# Altium project lamp_controller.PrjPcb (part 1 of 4)
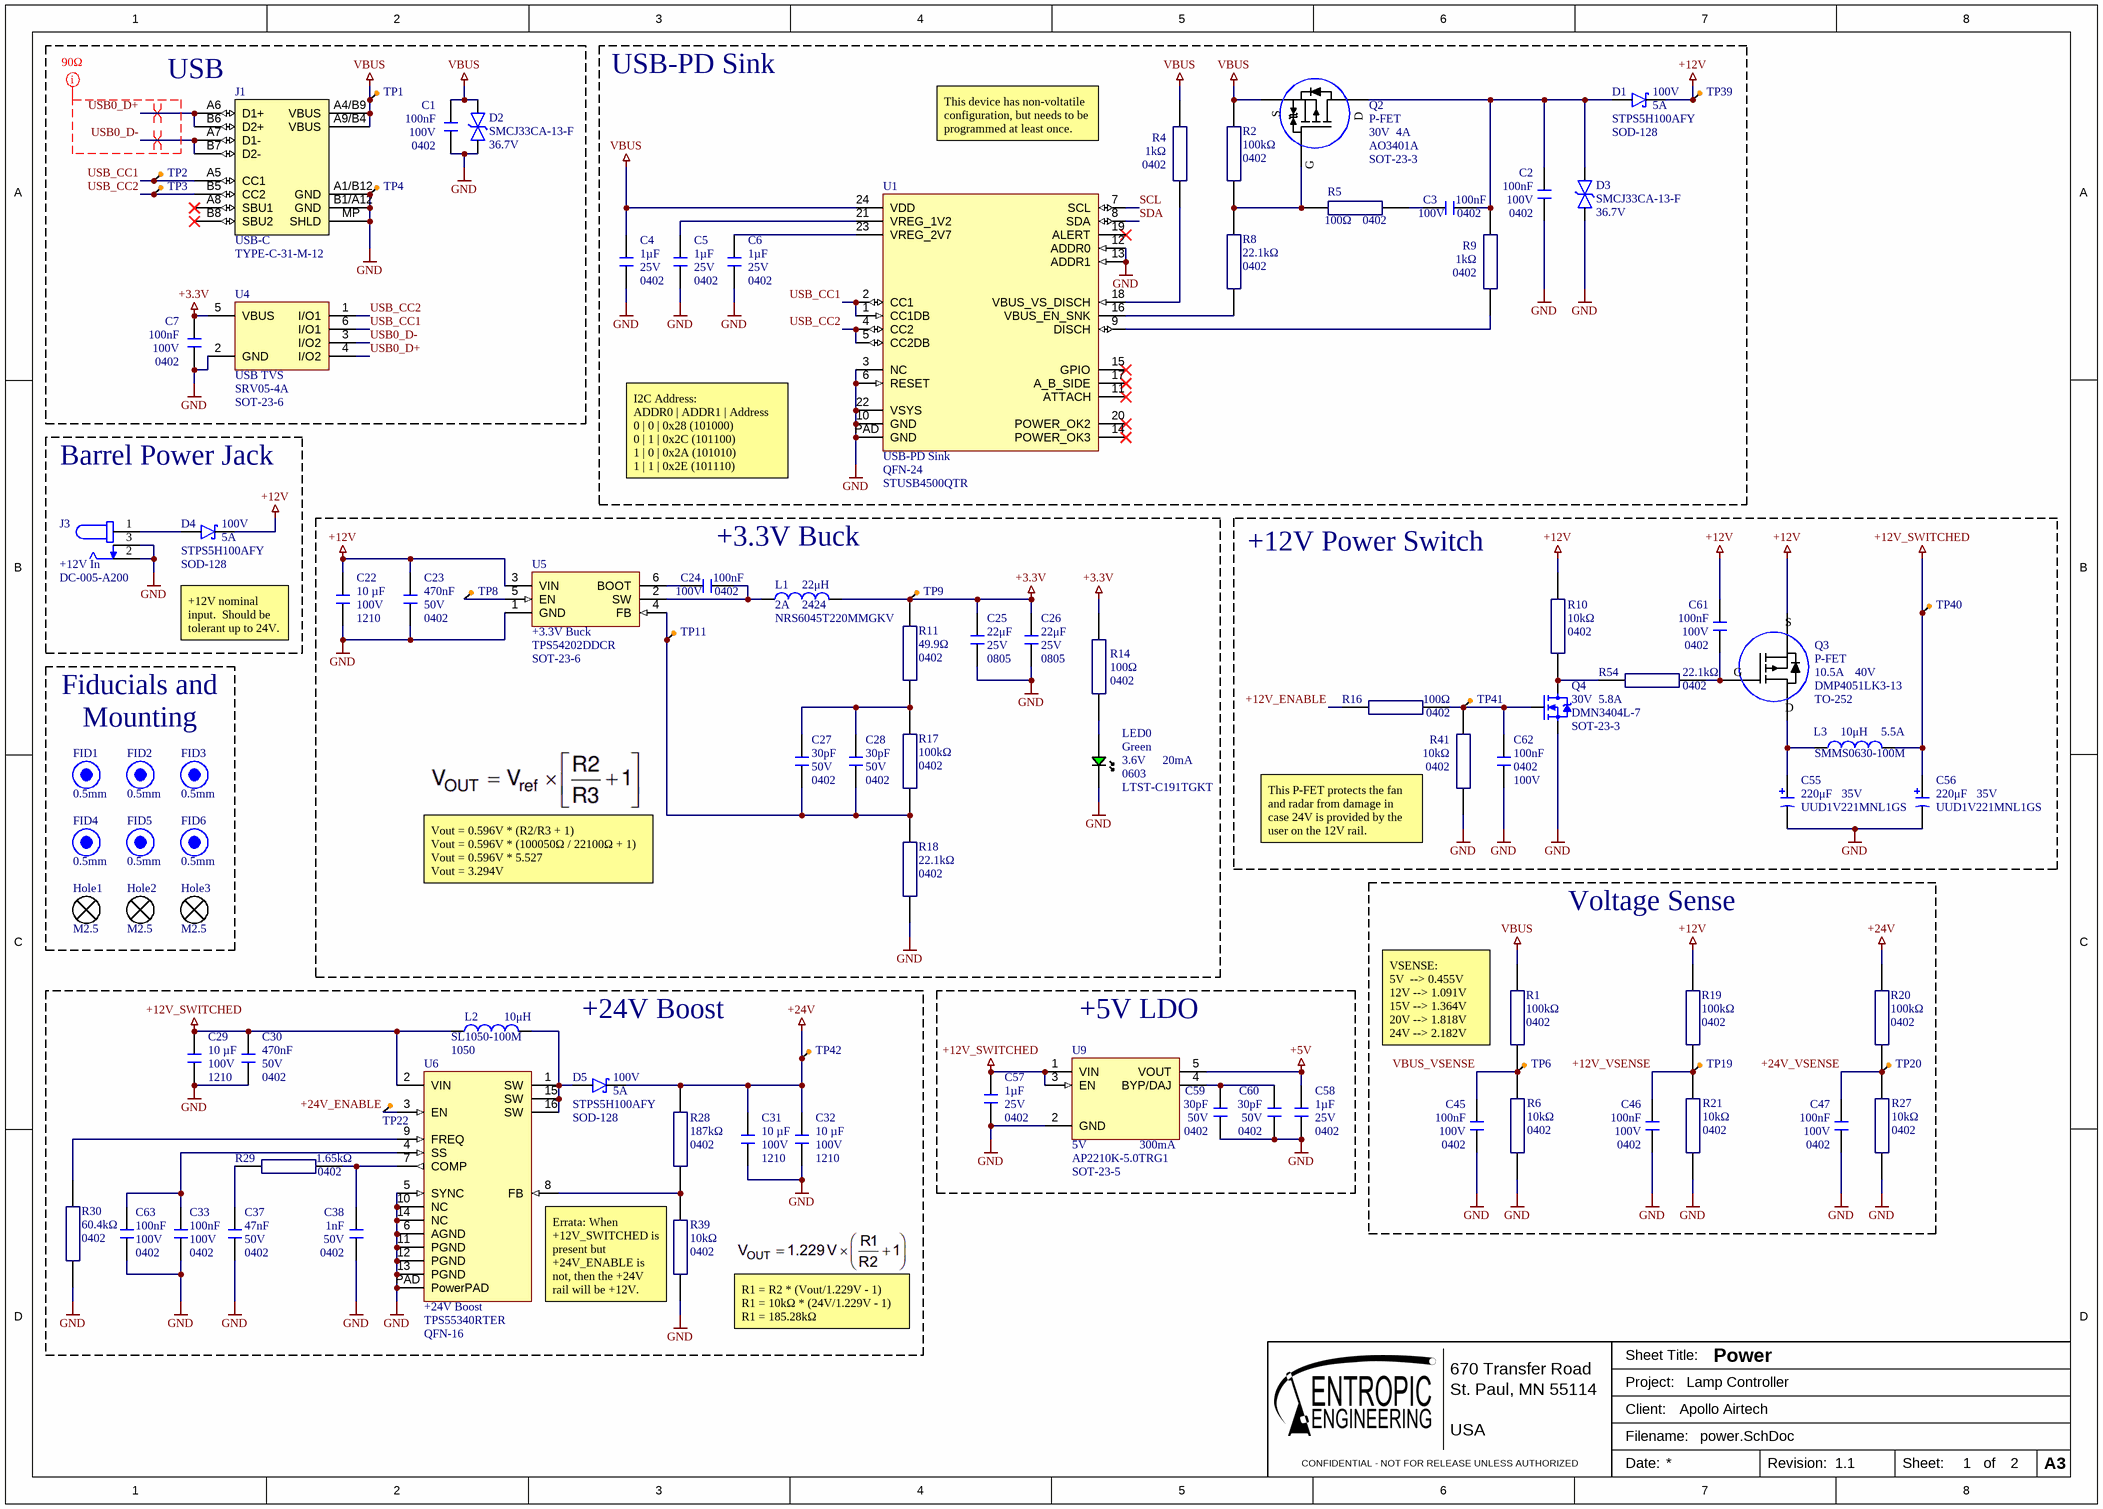
[diagram p0: power.SchDoc]
Revision: 1.1; Project: Lamp Controller; Client: Apollo Airtech
2 sheets, 211 parts. Net scope: global (net labels, ports and power ports of the same name join across sheets).
Board file: lamp_controller.PcbDoc
Sheets:
  power.SchDoc
  lamp_controller.SchDoc

## Sheet power.SchDoc: Power
size A3; SheetNumber: 1; SheetTotal: 2

### Parts
C1  value 100nF  Case/Package: 0402  Rated DC Voltage (URdc): 100V  [0402_capacitor]  (hidden comment: GRM155R62A104KE14D)
C2  value 100nF  Case/Package: 0402  Rated DC Voltage (URdc): 100V  [0402_capacitor]  (hidden comment: GRM155R62A104KE14D)
C3  value 100nF  Case/Package: 0402  Rated DC Voltage (URdc): 100V  [0402_capacitor]  (hidden comment: GRM155R62A104KE14D)
C4  Size Code: 0402  Capacitance: 1µF  Voltage: 25V  [0402_capacitor]  (hidden comment: GRM155R61E105KA12D)
C5  Size Code: 0402  Capacitance: 1µF  Voltage: 25V  [0402_capacitor]  (hidden comment: GRM155R61E105KA12D)
C6  Size Code: 0402  Capacitance: 1µF  Voltage: 25V  [0402_capacitor]  (hidden comment: GRM155R61E105KA12D)
C7  value 100nF  Case/Package: 0402  Rated DC Voltage (URdc): 100V  [0402_capacitor]  (hidden comment: GRM155R62A104KE14D)
C22  Voltage Rating: 100V  Case/Package: 1210  Capacitance: 10 µF  [1210_capacitor]  (hidden comment: GRM32EC72A106KE05L)
C23  Package: 0402  Voltage Rating (DC): 50V  Capacitance: 470nF  [0402_capacitor]  (hidden comment: GRM155R61H474KE11D)
C24  value 100nF  Case/Package: 0402  Rated DC Voltage (URdc): 100V  [0402_capacitor]  (hidden comment: GRM155R62A104KE14D)
C25  value 22μF  Rated DC Voltage (URdc): 25V  Case/Package: 0805  [0805_capacitor]  (hidden comment: GRT21BR61E226ME13L)
C26  value 22μF  Rated DC Voltage (URdc): 25V  Case/Package: 0805  [0805_capacitor]  (hidden comment: GRT21BR61E226ME13L)
C27  value 30pF  Rated DC Voltage (URdc): 50V  Case/Package: 0402  [0402_capacitor]  (hidden comment: GCM1555C1H300FA16D)
C28  value 30pF  Rated DC Voltage (URdc): 50V  Case/Package: 0402  [0402_capacitor]  (hidden comment: GCM1555C1H300FA16D)
C29  Voltage Rating: 100V  Case/Package: 1210  Capacitance: 10 µF  [1210_capacitor]  (hidden comment: GRM32EC72A106KE05L)
C30  Package: 0402  Voltage Rating (DC): 50V  Capacitance: 470nF  [0402_capacitor]  (hidden comment: GRM155R61H474KE11D)
C31  Voltage Rating: 100V  Case/Package: 1210  Capacitance: 10 µF  [1210_capacitor]  (hidden comment: GRM32EC72A106KE05L)
C32  Voltage Rating: 100V  Case/Package: 1210  Capacitance: 10 µF  [1210_capacitor]  (hidden comment: GRM32EC72A106KE05L)
C33  value 100nF  Case/Package: 0402  Rated DC Voltage (URdc): 100V  [0402_capacitor]  (hidden comment: GRM155R62A104KE14D)
C37  Case Code (Imperial): 0402  Capacitance: 47nF  Voltage Rating: 50V  [0402_capacitor]  (hidden comment: GRM155R71H473KE14D)
C38  Case/Package: 0402  Capacitance: 1nF  Voltage Rating: 50V  [0402_capacitor]  (hidden comment: CC0402KRX7R9BB102)
C45  value 100nF  Case/Package: 0402  Rated DC Voltage (URdc): 100V  [0402_capacitor]  (hidden comment: GRM155R62A104KE14D)
C46  value 100nF  Case/Package: 0402  Rated DC Voltage (URdc): 100V  [0402_capacitor]  (hidden comment: GRM155R62A104KE14D)
C47  value 100nF  Case/Package: 0402  Rated DC Voltage (URdc): 100V  [0402_capacitor]  (hidden comment: GRM155R62A104KE14D)
C55  Rated DC Voltage (URdc): 35V  Capacitance: 220μF  [UUD1V221MNL1GS]  (hidden comment: UUD1V221MNL1GS)
C56  Rated DC Voltage (URdc): 35V  Capacitance: 220μF  [UUD1V221MNL1GS]  (hidden comment: UUD1V221MNL1GS)
C57  Size Code: 0402  Capacitance: 1µF  Voltage: 25V  [0402_capacitor]  (hidden comment: GRM155R61E105KA12D)
C58  Size Code: 0402  Capacitance: 1µF  Voltage: 25V  [0402_capacitor]  (hidden comment: GRM155R61E105KA12D)
C59  value 30pF  Rated DC Voltage (URdc): 50V  Case/Package: 0402  [0402_capacitor]  (hidden comment: GCM1555C1H300FA16D)
C60  value 30pF  Rated DC Voltage (URdc): 50V  Case/Package: 0402  [0402_capacitor]  (hidden comment: GCM1555C1H300FA16D)
C61  value 100nF  Case/Package: 0402  Rated DC Voltage (URdc): 100V  [0402_capacitor]  (hidden comment: GRM155R62A104KE14D)
C62  value 100nF  Case/Package: 0402  Rated DC Voltage (URdc): 100V  [0402_capacitor]  (hidden comment: GRM155R62A104KE14D)
C63  value 100nF  Case/Package: 0402  Rated DC Voltage (URdc): 100V  [0402_capacitor]  (hidden comment: GRM155R62A104KE14D)
D1  Package: SOD-128  Current: 5A  Rep Pk Reverse Voltage-Max: 100V  [SOD128]  (hidden comment: STPS5H100AFY)
D2  Min Breakdown Voltage: 36.7V  [SMCJ33CA-13-F]  (hidden comment: SMCJ33CA-13-F)
D3  Min Breakdown Voltage: 36.7V  [SMCJ33CA-13-F]  (hidden comment: SMCJ33CA-13-F)
D4  Package: SOD-128  Current: 5A  Rep Pk Reverse Voltage-Max: 100V  [SOD128]  (hidden comment: STPS5H100AFY)
D5  Package: SOD-128  Current: 5A  Rep Pk Reverse Voltage-Max: 100V  [SOD128]  (hidden comment: STPS5H100AFY)
FID1  Package: 0.5mm  [fiducial-0.5]  (hidden comment: FID?)  (no BOM)
FID2  Package: 0.5mm  [fiducial-0.5]  (hidden comment: FID?)  (no BOM)
FID3  Package: 0.5mm  [fiducial-0.5]  (hidden comment: FID?)  (no BOM)
FID4  Package: 0.5mm  [fiducial-0.5]  (hidden comment: FID?)  (no BOM)
FID5  Package: 0.5mm  [fiducial-0.5]  (hidden comment: FID?)  (no BOM)
FID6  Package: 0.5mm  [fiducial-0.5]  (hidden comment: FID?)  (no BOM)
Hole1  M2.5  [m2.5_hole_no_pad]  (no BOM)
Hole2  M2.5  [m2.5_hole_no_pad]  (no BOM)
Hole3  M2.5  [m2.5_hole_no_pad]  (no BOM)
J1  USB-C  Manufacturer Part Number: TYPE-C-31-M-12  [USB_C_2.0_M12]
J3  +12V In  [DC-005-A200]
L1  Case/Size Code: 2424  Max Current Rating: 2A  Inductance-Nom (L): 22μH  [2424_inductor]  (hidden comment: NRS6045T220MMGKV)
L2  Inductance: 10μH  Package: 1050  [1050_inductor]  (hidden comment: SL1050-100M)
L3  Saturation Current: 5.5A  Inductance: 10μH  [SMMS0630]  (hidden comment: SMMS0630-100M)
LED0  Forward Current-Max: 20mA  Forward Voltage-Max: 3.6V  Color: Green  Package: 0603  [0603_diode]  (hidden comment: LTST-C191TGKT)
Q2  P-FET  Package: SOT-23-3  DS Breakdown Voltage-Min: 30V  Drain Current-Max (ID): 4A  [SOT95P280X115-3N]
Q3  Continuous Drain Current (ID): 10.5A  Drain to Source Voltage (Vdss): 40V  [TO-252]  (hidden comment: P-FET)
Q4  DS Breakdown Voltage-Min: 30V  Drain Current-Max (ID): 5.8A  [SOT-23-3]  (hidden comment: DMN3404L-7)
R1  value 100kΩ  Case/Package: 0402  [0402_resistor]  (hidden comment: RMCF0402FT100K)
R2  value 100kΩ  Case/Package: 0402  [0402_resistor]  (hidden comment: RMCF0402FT100K)
R4  Size Code: 0402  Resistance: 1kΩ  [0402_resistor]  (hidden comment: CR0402-FX-1001GLF)
R5  Case Code (Imperial): 0402  Resistance: 100Ω  [0402_resistor]  (hidden comment: RMCF0402FT100R)
R6  Case Code (Imperial): 0402  Resistance: 10kΩ  [0402_resistor]  (hidden comment: RMCF0402FT10K0)
R8  value 22.1kΩ  Case/Package: 0402  [0402_resistor]  (hidden comment: RC0402FR-0722K1L)
R9  Size Code: 0402  Resistance: 1kΩ  [0402_resistor]  (hidden comment: CR0402-FX-1001GLF)
R10  Case Code (Imperial): 0402  Resistance: 10kΩ  [0402_resistor]  (hidden comment: RMCF0402FT10K0)
R11  Resistance: 49.9Ω  Case Code (Imperial): 0402  [0402_resistor]  (hidden comment: RMCF0402FT49R9)
R14  Case Code (Imperial): 0402  Resistance: 100Ω  [0402_resistor]  (hidden comment: RMCF0402FT100R)
R16  Case Code (Imperial): 0402  Resistance: 100Ω  [0402_resistor]  (hidden comment: RMCF0402FT100R)
R17  value 100kΩ  Case/Package: 0402  [0402_resistor]  (hidden comment: RMCF0402FT100K)
R18  value 22.1kΩ  Case/Package: 0402  [0402_resistor]  (hidden comment: RC0402FR-0722K1L)
R19  value 100kΩ  Case/Package: 0402  [0402_resistor]  (hidden comment: RMCF0402FT100K)
R20  value 100kΩ  Case/Package: 0402  [0402_resistor]  (hidden comment: RMCF0402FT100K)
R21  Case Code (Imperial): 0402  Resistance: 10kΩ  [0402_resistor]  (hidden comment: RMCF0402FT10K0)
R27  Case Code (Imperial): 0402  Resistance: 10kΩ  [0402_resistor]  (hidden comment: RMCF0402FT10K0)
R28  Case/Package: 0402  Resistance: 187kΩ  [0402_resistor]  (hidden comment: AC0402FR-07187KL)
R29  Resistance: 1.65kΩ  Case/Package: 0402  [0402_resistor]  (hidden comment: RC0402FR-071K65L)
R30  Resistance: 60.4kΩ  Case/Package: 0402  [0402_resistor]  (hidden comment: RC0402FR-0760K4L)
R39  Case Code (Imperial): 0402  Resistance: 10kΩ  [0402_resistor]  (hidden comment: RMCF0402FT10K0)
R41  Case Code (Imperial): 0402  Resistance: 10kΩ  [0402_resistor]  (hidden comment: RMCF0402FT10K0)
R54  value 22.1kΩ  Case/Package: 0402  [0402_resistor]  (hidden comment: RC0402FR-0722K1L)
TP1  VBUS  [test_point-1]  (value not drawn)  (no BOM)
TP2  CC1  [test_point-1]  (value not drawn)  (no BOM)
TP3  CC2  [test_point-1]  (value not drawn)  (no BOM)
TP4  GND  [test_point-1]  (value not drawn)  (no BOM)
TP6  VBUS Sense  [test_point-1]  (value not drawn)  (no BOM)
TP8  Buck EN  [test_point-1]  (value not drawn)  (no BOM)
TP9  +3.3V  [test_point-1]  (value not drawn)  (no BOM)
TP11  Buck Feedback  [test_point-1]  (value not drawn)  (no BOM)
TP19  +12V Sense  [test_point-1]  (value not drawn)  (no BOM)
TP20  +24V Sense  [test_point-1]  (value not drawn)  (no BOM)
TP22  +24V Enable  [test_point-1]  (value not drawn)  (no BOM)
TP39  +12V  [test_point-1]  (value not drawn)  (no BOM)
TP40  +12V Switched  [test_point-1]  (value not drawn)  (no BOM)
TP41  +12V Enable  [test_point-1]  (value not drawn)  (no BOM)
TP42  +24V  [test_point-1]  (value not drawn)  (no BOM)
U1  USB-PD Sink  [QFN-24]
U4  USB TVS  Case/Package: SOT-23-6  [SOT95P280X110-6N]
U5  +3.3V Buck  [SOT-23-6]
U6  +24V Boost  Package: QFN-16  [QDF-16]
U9  Output Current1-Max: 300mA  Output Voltage1-Nom: 5V  [SOT-23-5]  (hidden comment: AP2210K-5.0TRG1)

### Blocks framed on the sheet
USB: C1 C7 D2 J1 TP1-TP4 U4
+12V Power Switch: C55 C56 C61 C62 L3 Q3 Q4 R10 R16 R41 R54 TP40 TP41

### Nets
+3.3V: C7.2 C25.2 C26.2 L1.2 R11.2 R14.2 TP9.1 U4.5(VBUS)
+5V: C58.2 U9.5(VOUT)
+12V: C22.2 C23.2 C61.2 D1.1 D4.1 Q3.3(S) R10.2 R19.2 TP39.1 U5.3(VIN)
+12V_SWITCHED: C29.2 C30.2 C56.1 C57.2 L2.1 L3.2 TP40.1 U6.2(VIN) U9.1(VIN) U9.3(EN)
+24V: C31.2 C32.2 D5.1 R20.2 R28.2 TP42.1
GND: C1.1 C2.1 C4.1 C5.1 C6.1 C7.1 C22.1 C23.1 C25.1 C26.1 C29.1 C30.1 C31.1 C32.1 C33.1 C37.1 C38.1 C45.1 C46.1 C47.1 C55.2 C56.2 C57.1 C58.1 C59.1 C60.1 C62.1 C63.1 D2.2 D3.2 J1.A1/B12(GND) J1.B1/A12(GND) J1.MP(SHLD) J3.2(SLEEVE) J3.3(SWITCH) LED0.2(K) Q4.2(S) R6.1 R18.1 R21.1 R27.1 R30.1 R39.1 R41.1 TP4.1 U1.3(NC) U1.6(RESET) U1.10(GND) U1.12(ADDR0) U1.13(ADDR1) U1.22(VSYS) U1.PAD(GND) U4.2(GND) U5.1(GND) U6.5(SYNC) U6.6(AGND) U6.10(NC) U6.11(PGND) U6.12(PGND) U6.13(PGND) U6.14(NC) U6.PAD(PowerPAD) U9.2(GND)
VBUS: C1.2 C4.2 D2.1 J1.A4/B9(VBUS) J1.A9/B4(VBUS) Q2.2(S) R1.2 R2.2 R4.2 TP1.1 U1.24(VDD)
+12V_ENABLE: R16.1
+12V_VSENSE: C46.2 R19.1 R21.2 TP19.1
+24V_ENABLE: TP22.1 U6.3(EN)
+24V_VSENSE: C47.2 R20.1 R27.2 TP20.1
SCL: U1.7(SCL)
SDA: U1.8(SDA)
USB0_D+: J1.A6(D1+) J1.B6(D2+) U4.4(I/O2)
USB0_D-: J1.A7(D1-) J1.B7(D2-) U4.3(I/O2)
USB_CC1: J1.A5(CC1) TP2.1 U1.1(CC1DB) U1.2(CC1) U4.6(I/O1)
USB_CC2: J1.B5(CC2) TP3.1 U1.4(CC2) U1.5(CC2DB) U4.1(I/O1)
VBUS_VSENSE: C45.2 R1.1 R6.2 TP6.1
NetC2_2: C2.2 C3.1 D1.2 D3.1 Q2.3(D) R9.2
NetC3_2: C3.2 R5.2
NetC5_2: C5.2 U1.21(VREG_1V2)
NetC6_2: C6.2 U1.23(VREG_2V7)
NetC24_1: C24.1 L1.1 U5.2(SW)
NetC24_2: C24.2 U5.6(BOOT)
NetC27_1: C27.1 C28.1 R17.1 R18.2 TP11.1 U5.4(FB)
NetC27_2: C27.2 C28.2 R11.1 R17.2
NetC33_2: C33.2 C63.2 U6.4(SS)
NetC37_2: C37.2 R29.1
NetC38_2: C38.2 R29.2 U6.7(COMP)
NetC55_1: C55.1 L3.1 Q3.2(D)
NetC59_2: C59.2 C60.2 U9.4(BYP/DAJ)
NetC61_1: C61.1 Q3.1(G) R54.2
NetC62_2: C62.2 Q4.1(G) R16.2 R41.2 TP41.1
NetD4_2: D4.2 J3.1(TIP)
NetD5_2: D5.2 L2.2 U6.1(SW) U6.15(SW) U6.16(SW)
NetLED0_1: LED0.1(A) R14.1
NetQ2_1: Q2.1(G) R2.1 R5.1 R8.2
NetQ4_3: Q4.3(D) R10.1 R54.1
NetR4_1: R4.1 U1.18(VBUS_VS_DISCH)
NetR8_1: R8.1 U1.16(VBUS_EN_SNK)
NetR9_1: R9.1 U1.9(DISCH)
NetR28_1: R28.1 R39.2 U6.8(FB)
NetR30_2: R30.2 U6.9(FREQ)
NetTP8_1: TP8.1 U5.5(EN)

Not connected (* = marked no-connect by the designer): J1 A8(SBU1)* B8(SBU2)*; U1 11(ATTACH)* 14(POWER_OK3)* 15(GPIO)* 17(A_B_SIDE)* 19(ALERT)* 20(POWER_OK2)*

### Layout directives
net class 90_OHM: USB0_D+, USB0_D-
differential pair; differential pair class USB_DIFF: USB0_D+, USB0_D-

### Notes on the sheet
- USB-PD Sink
- This device has non-voltatile configuration, but needs to be programmed at least once.
- Barrel Power Jack
- I2C Address:
  ADDR0 | ADDR1 | Address
  0 | 0 | 0x28 (101000)
  0 | 1 | 0x2C (101100)
  1 | 0 | 0x2A (101010)
  1 | 1 | 0x2E (101110)
- (near C24) +3.3V Buck
- +12V nominal input.  Should be tolerant up to 24V.
- Fiducials and Mounting
- (near R41) This P-FET protects the fan and radar from damage in case 24V is provided by the user on the 12V rail.
- Vout = 0.596V * (R2/R3 + 1)
  Vout = 0.596V * (100050Ω / 22100Ω + 1)
  Vout = 0.596V * 5.527
  Vout = 3.294V
- Voltage Sense
- +24V Boost
- (near U9) +5V LDO
- VSENSE:
  5V  --> 0.455V
  12V --> 1.091V
  15V --> 1.364V
  20V --> 1.818V
  24V --> 2.182V
- Errata: When +12V_SWITCHED is present but +24V_ENABLE is not, then the +24V rail will be +12V.
- R1 = R2 * (Vout/1.229V - 1)
  R1 = 10kΩ * (24V/1.229V - 1)
  R1 = 185.28kΩ
- 670 Transfer Road
- St. Paul, MN 55114
- Sheet Title:
- Project:
- CONFIDENTIAL - NOT FOR RELEASE UNLESS AUTHORIZED
- USA
- Client:
- Filename:
- Date:
- Revision:
- Sheet:
- of
- A3